# EAGLE design Two-Buttons (EAGLE 9.6.2)
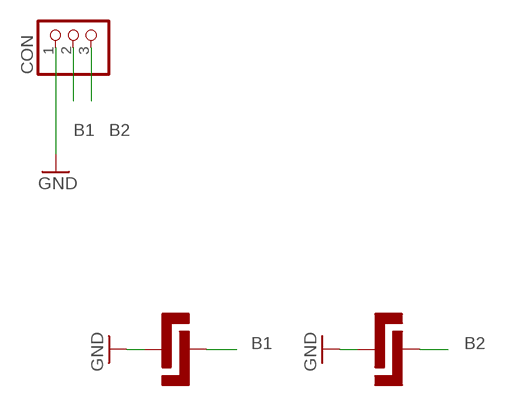
[diagram p0: schematic, sheet 1]

## Parts
BTN1  BTN_5MM_LONG  [BTN_5MM_LONG]
BTN2  BTN_5MM_LONG  [BTN_5MM_LONG]
CON  PINHD-1X3  [1X03]

## Nets
B1: BTN1.P$1 CON.2
B2: BTN2.P$1 CON.3
GND: BTN1.P$2 BTN2.P$2 CON.1

## Library data of the parts
BTN1 BTN2 = surfacebuttons:BTN_5MM_LONG
CON = pinhead:PINHD-1X3: PIN HEADER

## Board
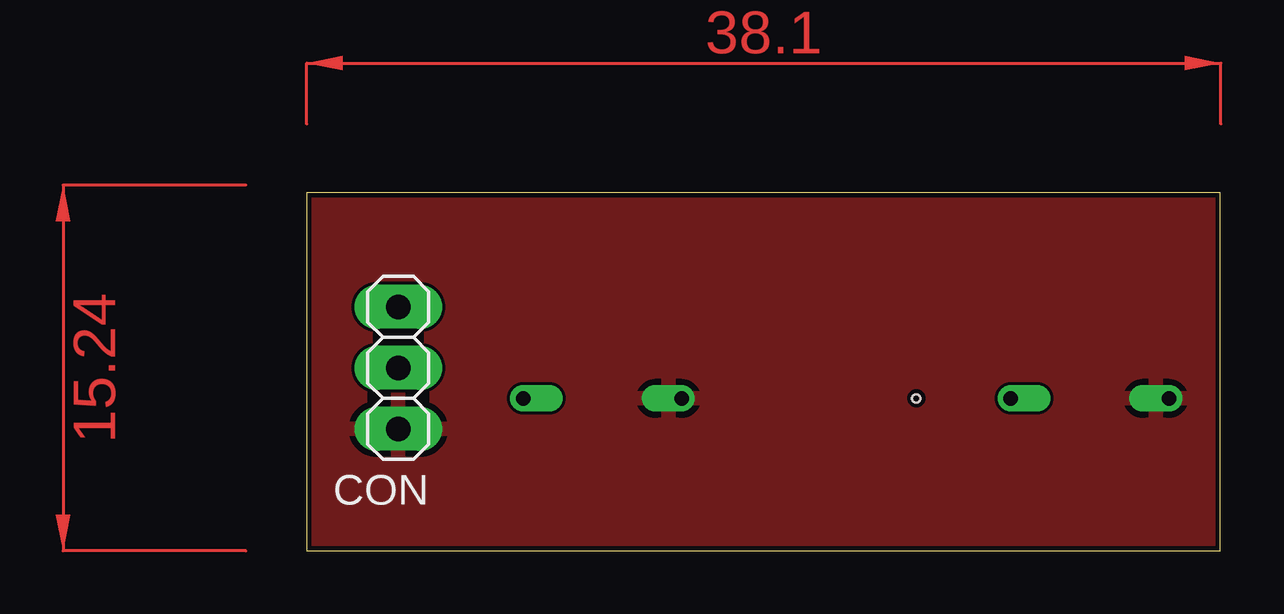
[diagram p1: board, top side]
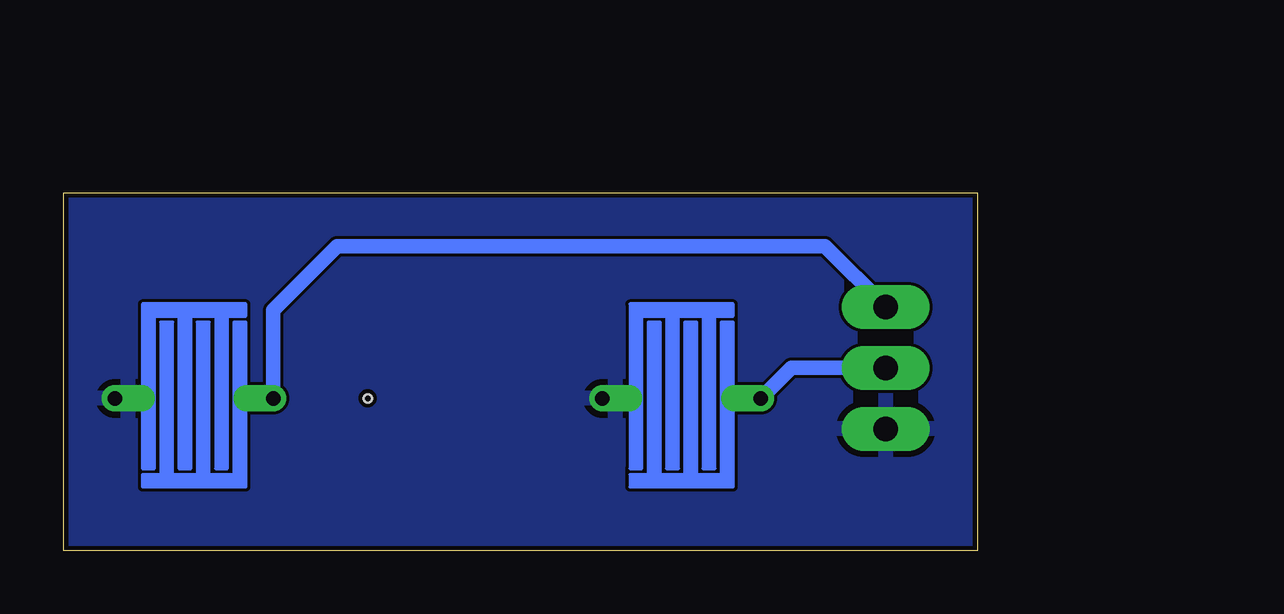
[diagram p2: board, bottom side, seen from below]

Size 38.08 x 14.91 mm. Coordinates in mm from the lower left corner, seen from the top.
Outline: 0,0 38.08,0 38.08,14.91 0,14.91 0,0
Copper layers (1*16): Top 0.035mm / dielectric 1.6mm / Bottom 0.035mm
Design rules "jlcpcb-2layers": minimum track width 5mil, minimum drill 0.3mm, track to track 5mil, track to pad 5mil, pad to pad 5mil, via to via 5mil, smd to smd 5mil, copper to edge 0.2mm, drill to drill 6mil, minimum pad ring 10mil, minimum via ring 3mil, stop-mask expansion 4mil, vias tented up to drill 0mil, thermal gap 10mil
Holes 0.35 mm at 25.4,6.35

### Footprints (pad centres in the part's own frame; a part is rotated, then mirrored left to right if it is on the bottom)
BTN_5MM_LONG = drill 0.6 offset: P$1 -3.175,-0.127; P$2 3.429,-0.127
1X03 = drill 1.016 long: 1 -2.54,0; 2 0,0; 3 2.54,0

### Placement (x,y rotation side)
BTN1  12.19,6.48 0 top
BTN2  32.51,6.48 0 top
CON  3.81,7.62 90 top

### Tracks (layer width: path | path; a pad name or v marks a point on that pad's centre or on a via)
B1
  Bottom 0.61: CON.2 7.75,7.62 BTN1.P$1
B2
  Bottom 0.61: CON.3 6.35,12.7 26.67,12.7 29.34,10.03 BTN2.P$1
GND
  pour Top: 0,15.24 0,0 38.1,0 38.1,15.24
  pour Bottom: 0,15.24 38.1,15.24 38.1,0 0,0
(copper drawn outside any net)
  shapes: Top area x2